# Altium schematic sheet TCAN1146_PWR_MGMT.SchDoc
size D; SheetNumber: 8; SheetTotal: 8
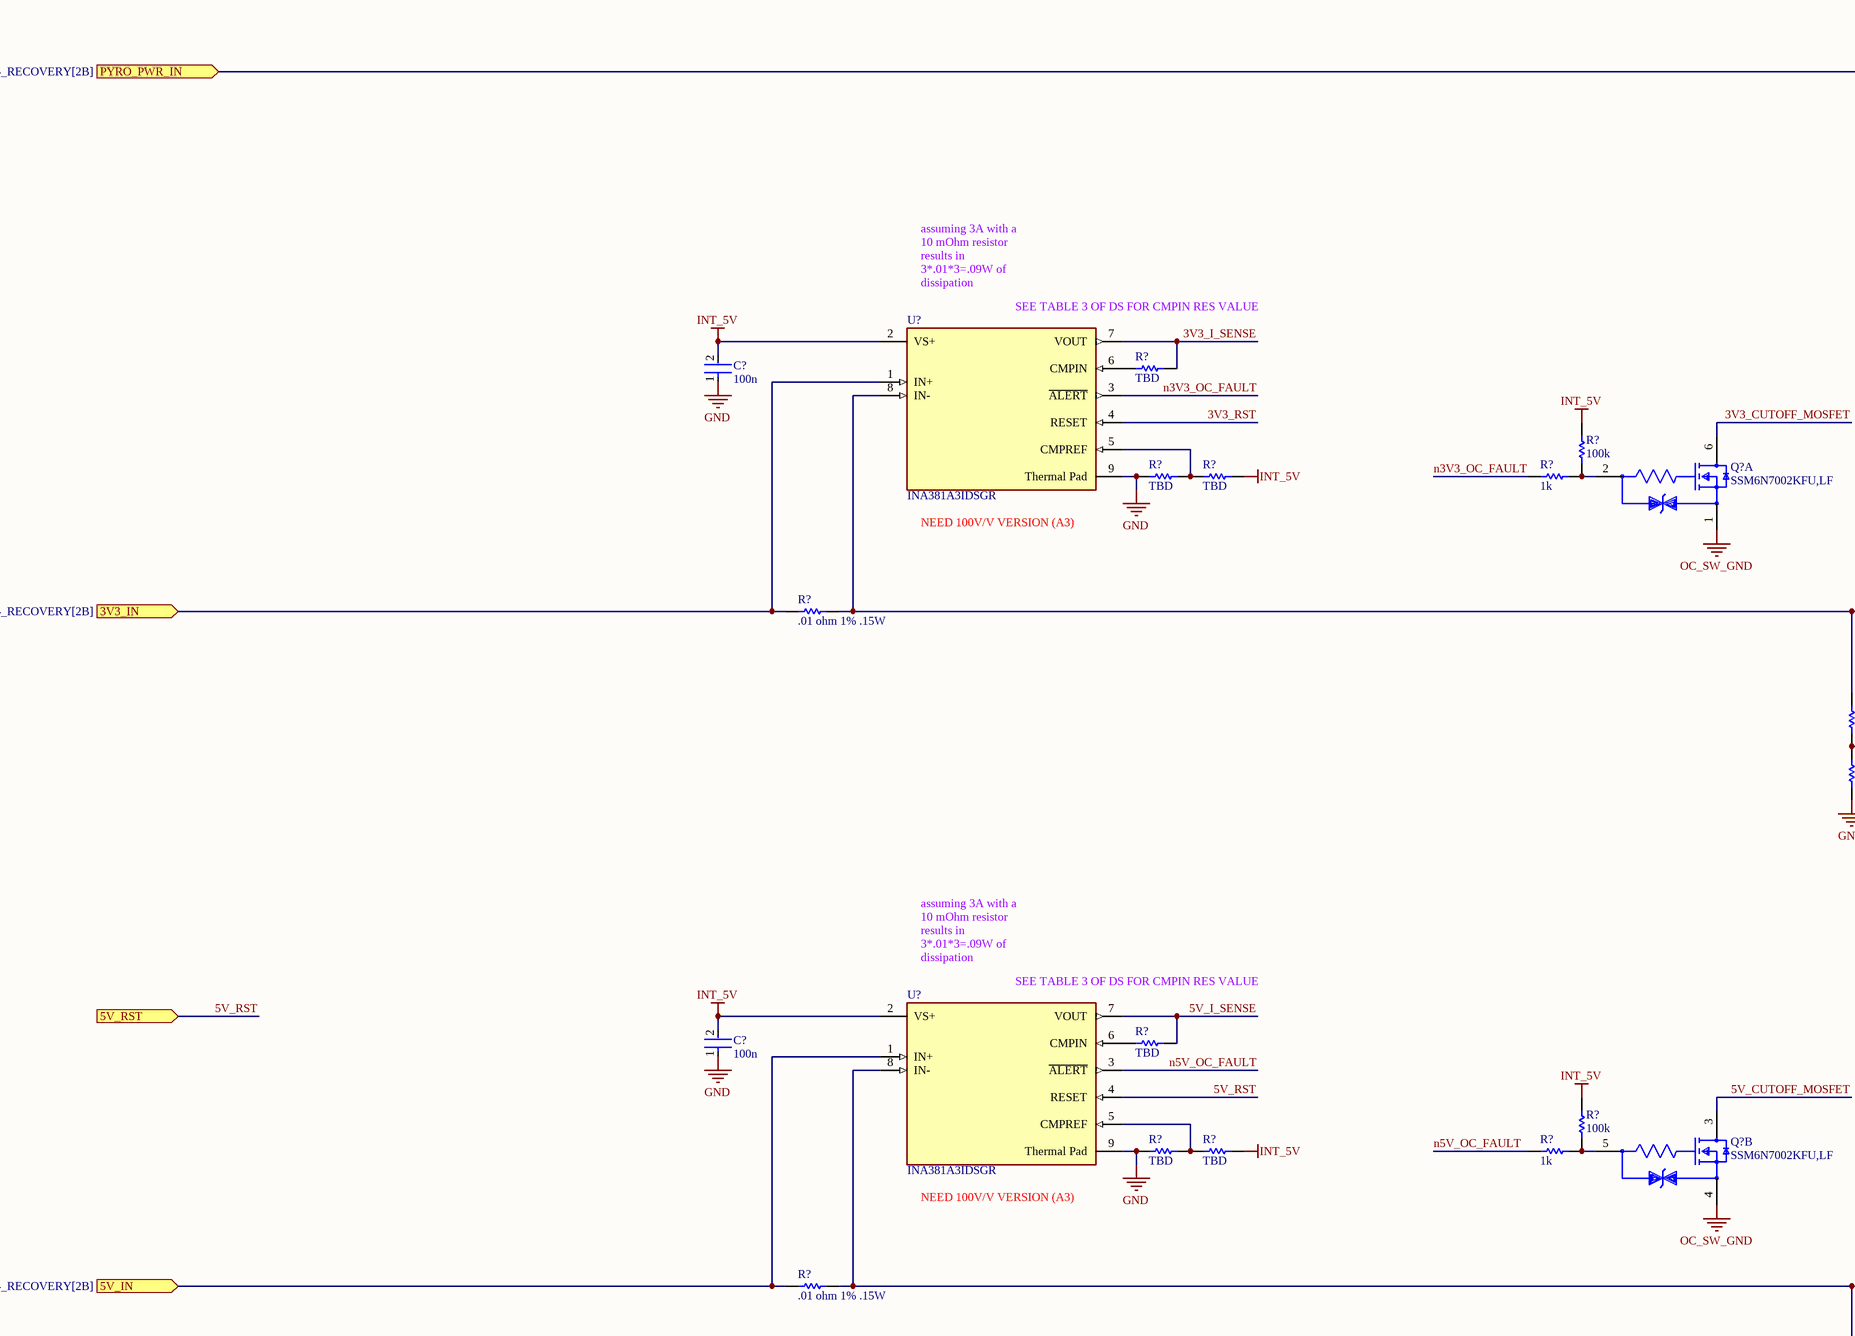
[diagram p0: TCAN1146_PWR_MGMT.SchDoc, top left]
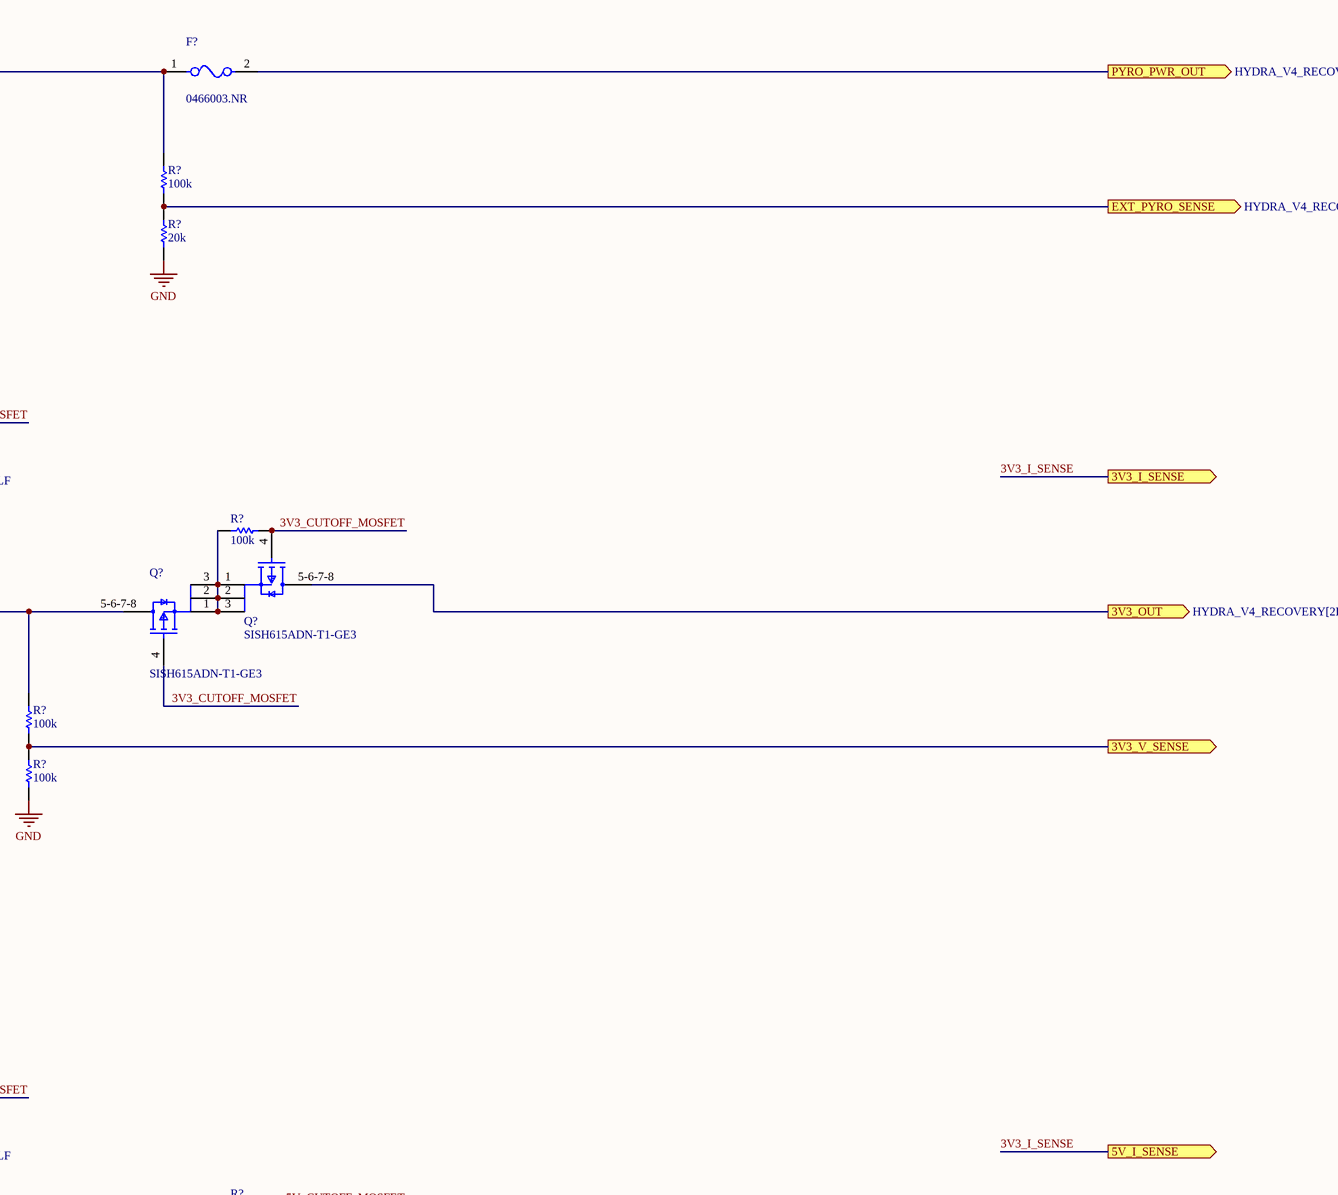
[diagram p1: TCAN1146_PWR_MGMT.SchDoc, top right]
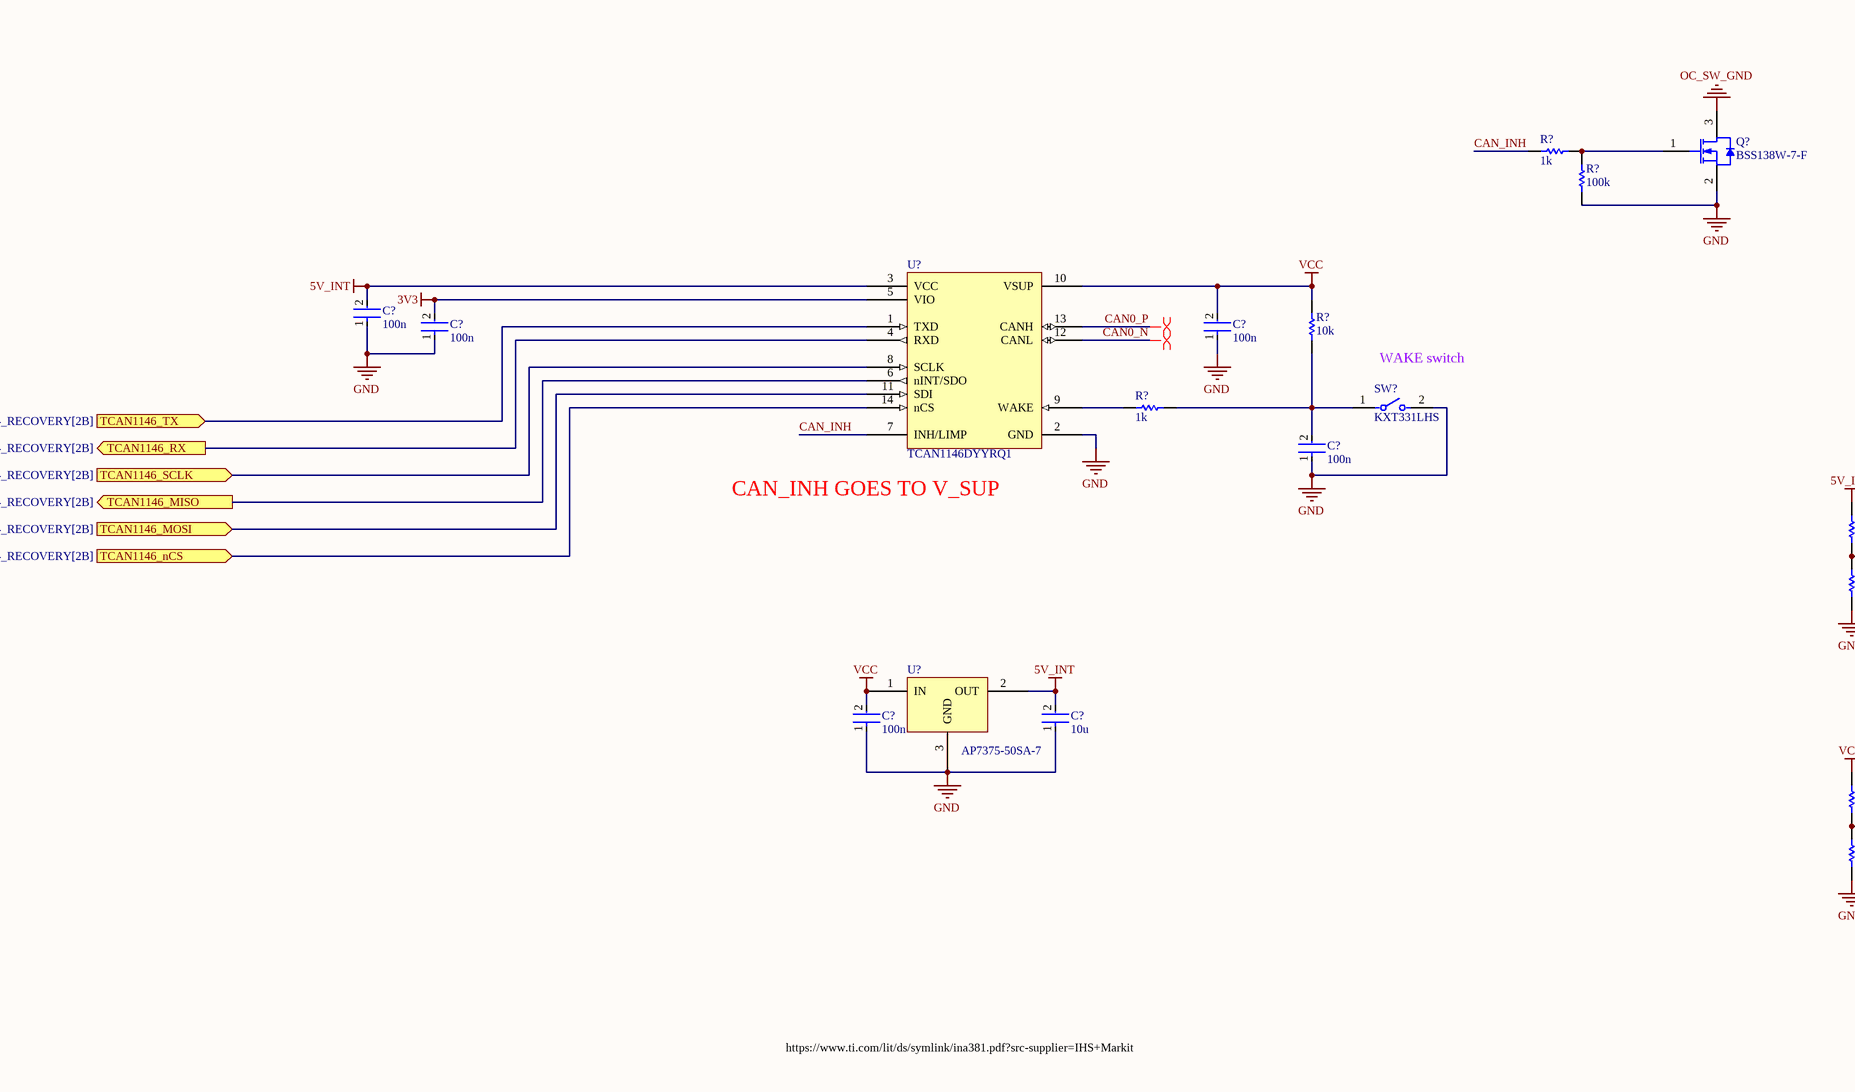
[diagram p2: TCAN1146_PWR_MGMT.SchDoc, bottom left]
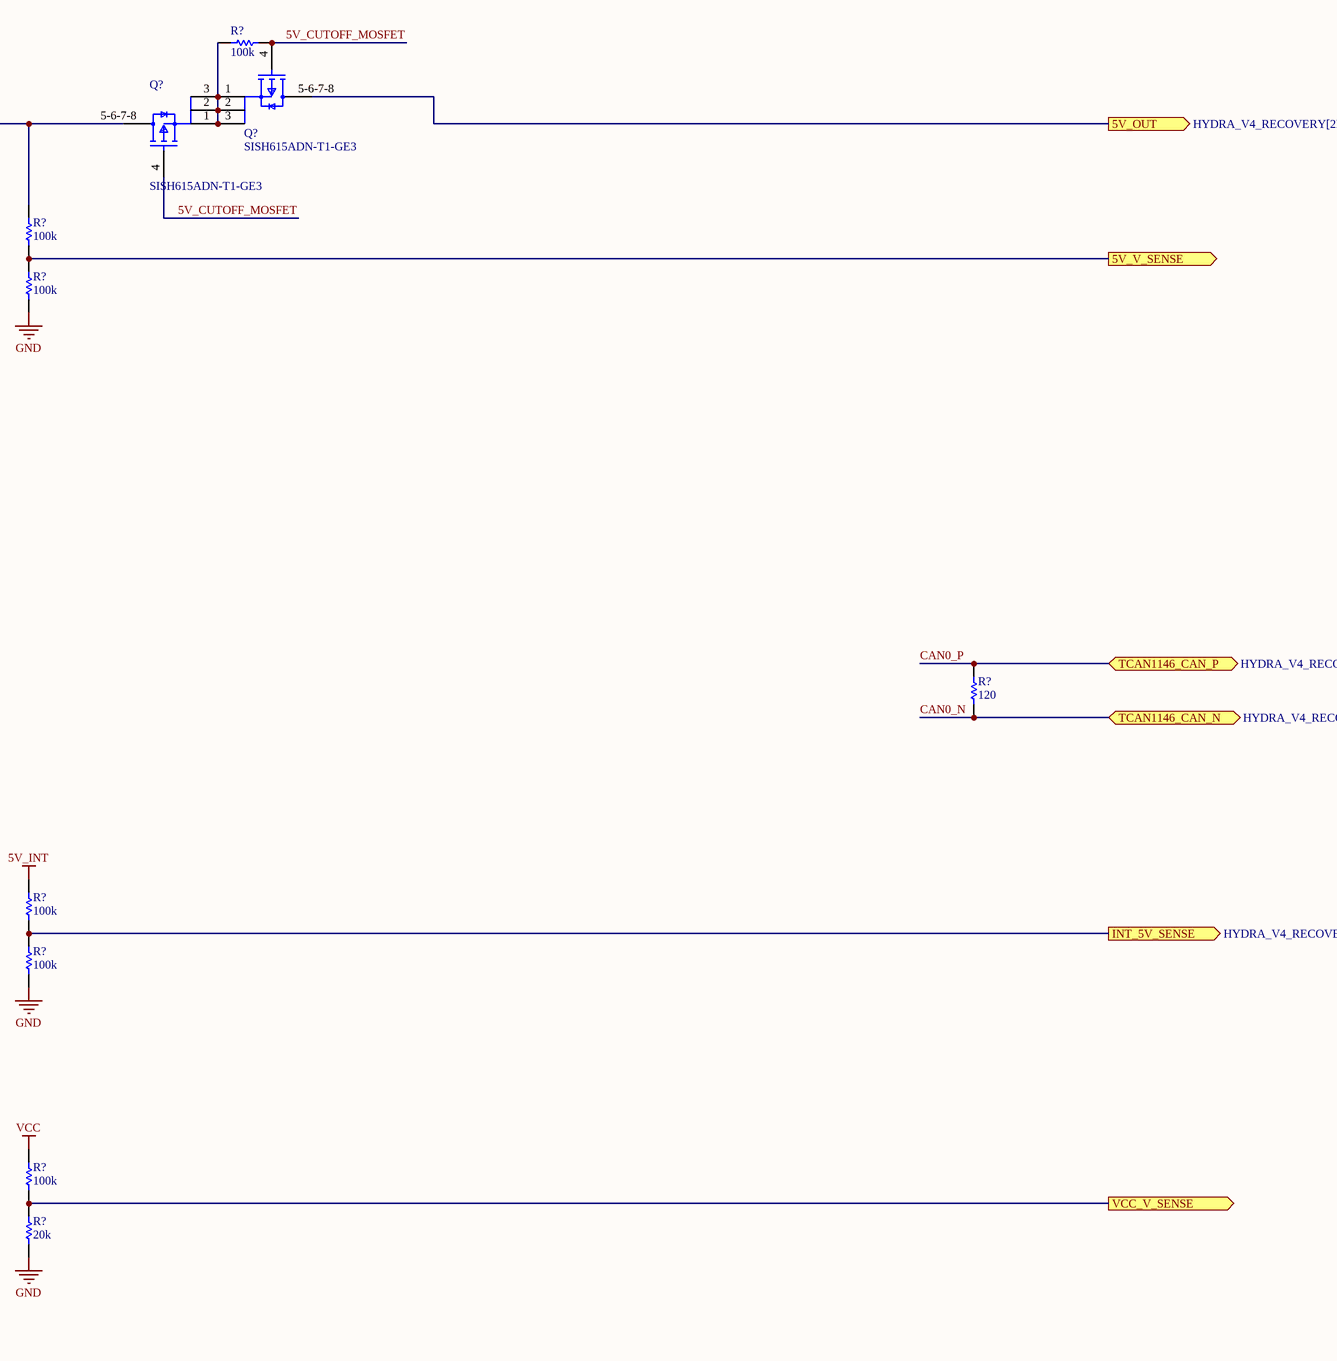
[diagram p3: TCAN1146_PWR_MGMT.SchDoc, bottom right]

## Parts
(Parts that share a designator on the sheet are numbered #1, #2 ... from top to bottom, then left to right.)
C?#1  100n  [FP-0402-L_1_0_0_05-W_0_5-IPC_A]
C?#2  100n  [FP-0402-L_1_0_0_05-W_0_5-IPC_A]
C?#3  100n  [FP-0402-L_1_0_0_05-W_0_5-IPC_A]
C?#4  100n  [FP-0402-L_1_0_0_05-W_0_5-IPC_A]
C?#5  100n  [FP-0402-L_1_0_0_05-W_0_5-IPC_A]
C?#6  100n  [FP-0402-L_1_0_0_05-W_0_5-IPC_A]
C?#7  100n  [FP-0402-L_1_0_0_05-W_0_5-IPC_A]
C?#8  10u  [FP-0402-L_1_0_0_05-W_0_5-IPC_A]
F?  0466003.NR  [FP-0466-MFG]
Q?#1  SSM6N7002KFU,LF  [FP-SSOP6-P-0_65A-MFG]  (part A of 2)
Q?#2  SISH615ADN-T1-GE3  [SISH615ADN-T1-GE3-Footprint-1]
Q?#3  SISH615ADN-T1-GE3  [SISH615ADN-T1-GE3-Footprint-1]
Q?#4  SSM6N7002KFU,LF  [FP-SSOP6-P-0_65A-MFG]  (part B of 2)
Q?#5  SISH615ADN-T1-GE3  [SISH615ADN-T1-GE3-Footprint-1]
Q?#6  SISH615ADN-T1-GE3  [SISH615ADN-T1-GE3-Footprint-1]
Q?#7  BSS138W-7-F  [DIOD-SOT323-3_V]
R?#1  100k  [R0603B]
R?#2  20k  [R0603B]
R?#3  TBD  [R0603B]
R?#4  100k  [R0603B]
R?#5  TBD  [R0603B]
R?#6  TBD  [R0603B]
R?#7  1k  [R0603B]
R?#8  100k  [R0603B]
R?#9  .01 ohm 1% .15W  [R0805B]
R?#10  100k  [R0603B]
R?#11  100k  [R0603B]
R?#12  TBD  [R0603B]
R?#13  100k  [R0603B]
R?#14  TBD  [R0603B]
R?#15  TBD  [R0603B]
R?#16  1k  [R0603B]
R?#17  100k  [R0603B]
R?#18  .01 ohm 1% .15W  [R0805B]
R?#19  100k  [R0603B]
R?#20  100k  [R0603B]
R?#21  1k  [R0603B]
R?#22  100k  [R0603B]
R?#23  120  [R0603B]
R?#24  10k  [R0603B]
R?#25  1k  [R0603B]
R?#26  100k  [R0603B]
R?#27  100k  [R0603B]
R?#28  100k  [R0603B]
R?#29  20k  [R0603B]
SW?  KXT331LHS  [FP-KXT331LHS-MFG]
U?#1  INA381A3IDSGR  [FP-DSG0008A-IPC_A]
U?#2  INA381A3IDSGR  [FP-DSG0008A-IPC_A]
U?#3  TCAN1146DYYRQ1  [TCAN1146DYYRQ1-Footprint-1]
U?#4  AP7375-50SA-7  [AP7375-50SA-7-Footprint-1]

## Ports
3V3_I_SENSE (out), 3V3_IN (in, see HYDRA_V4_RECOVERY[2B]), 3V3_OUT (out, see HYDRA_V4_RECOVERY[2B]), 3V3_V_SENSE (out), 5V_I_SENSE (out), 5V_IN (in, see HYDRA_V4_RECOVERY[2B]), 5V_OUT (out, see HYDRA_V4_RECOVERY[2B]), 5V_RST (in), 5V_V_SENSE (out), EXT_PYRO_SENSE (out, see HYDRA_V4_RECOVERY[2B]), INT_5V_SENSE (out, see HYDRA_V4_RECOVERY[2B]), PYRO_PWR_IN (in, see HYDRA_V4_RECOVERY[2B]), PYRO_PWR_OUT (out, see HYDRA_V4_RECOVERY[2B]), TCAN1146_CAN_N (bidir, see HYDRA_V4_RECOVERY[2B]), TCAN1146_CAN_P (bidir, see HYDRA_V4_RECOVERY[2B]), TCAN1146_MISO (out, see HYDRA_V4_RECOVERY[2B]), TCAN1146_MOSI (in, see HYDRA_V4_RECOVERY[2B]), TCAN1146_nCS (in, see HYDRA_V4_RECOVERY[2B]), TCAN1146_RX (out, see HYDRA_V4_RECOVERY[2B]), TCAN1146_SCLK (in, see HYDRA_V4_RECOVERY[2B]), TCAN1146_TX (in, see HYDRA_V4_RECOVERY[2B]), VCC_V_SENSE (out)

## Nets
3V3: C?#4.2 U?#3.5(VIO)
5V_INT: C?#3.2 C?#8.2 R?#26.2 U?#3.3(VCC) U?#4.2(OUT)
GND: C?#1.1 C?#2.1 C?#3.1 C?#4.1 C?#5.1 C?#6.1 C?#7.1 C?#8.1 Q?#7.2(S) R?#2.1 R?#5.1 R?#11.1 R?#14.1 R?#20.1 R?#22.2 R?#27.1 R?#29.1 SW?.2 U?#1.9(Thermal_Pad) U?#2.9(Thermal_Pad) U?#3.2(GND) U?#4.3(GND)
INT_5V: C?#1.2 C?#2.2 R?#4.2 R?#6.1 R?#13.2 R?#15.1 U?#1.2(VS+) U?#2.2(VS+)
OC_SW_GND: Q?#1.1(Source1) Q?#4.4(Source2) Q?#7.3(D)
VCC: C?#5.2 C?#7.2 R?#24.2 R?#28.2 U?#3.10(VSUP) U?#4.1(IN)
3V3_CUTOFF_MOSFET: Q?#1.6(Drain1) Q?#2.4(G) Q?#3.4(G) R?#8.2
3V3_I_SENSE: R?#3.2 U?#1.7(VOUT) ; port 3V3_I_SENSE, port 5V_I_SENSE
3V3_IN: R?#9.2 U?#1.1(IN+) ; port 3V3_IN
3V3_OUT: Q?#2.5-6-7-8(D) ; port 3V3_OUT
3V3_RST: U?#1.4(RESET)
3V3_V_SENSE: R?#10.1 R?#11.2 ; port 3V3_V_SENSE
5V_CUTOFF_MOSFET: Q?#4.3(Drain2) Q?#5.4(G) Q?#6.4(G) R?#17.2
5V_I_SENSE: R?#12.2 U?#2.7(VOUT)
5V_IN: R?#18.2 U?#2.1(IN+) ; port 5V_IN
5V_OUT: Q?#5.5-6-7-8(D) ; port 5V_OUT
5V_RST: U?#2.4(RESET) ; port 5V_RST
5V_V_SENSE: R?#19.1 R?#20.2 ; port 5V_V_SENSE
CAN0_N: R?#23.1 U?#3.12(CANL) ; port TCAN1146_CAN_N
CAN0_P: R?#23.2 U?#3.13(CANH) ; port TCAN1146_CAN_P
CAN_INH: R?#21.1 U?#3.7(INH/LIMP)
EXT_PYRO_SENSE: R?#1.1 R?#2.2 ; port EXT_PYRO_SENSE
INT_5V_SENSE: R?#26.1 R?#27.2 ; port INT_5V_SENSE
n3V3_OC_FAULT: R?#7.1 U?#1.3(~{ALERT})
n5V_OC_FAULT: R?#16.1 U?#2.3(~{ALERT})
PYRO_PWR_IN: F?.1 R?#1.2 ; port PYRO_PWR_IN
PYRO_PWR_OUT: F?.2 ; port PYRO_PWR_OUT
TCAN1146_MISO: U?#3.6(nINT/SDO) ; port TCAN1146_MISO
TCAN1146_MOSI: U?#3.11(SDI) ; port TCAN1146_MOSI
TCAN1146_nCS: U?#3.14(nCS) ; port TCAN1146_nCS
TCAN1146_RX: U?#3.4(RXD) ; port TCAN1146_RX
TCAN1146_SCLK: U?#3.8(SCLK) ; port TCAN1146_SCLK
TCAN1146_TX: U?#3.1(TXD) ; port TCAN1146_TX
VCC_V_SENSE: R?#28.1 R?#29.2 ; port VCC_V_SENSE
NetC?#6_2: C?#6.2 R?#24.1 R?#25.1 SW?.1
NetQ?#1_2: Q?#1.2(Gate1) R?#4.1 R?#7.2
NetQ?#2_1: Q?#2.1(S) Q?#2.2(S) Q?#2.3(S) Q?#3.1(S) Q?#3.2(S) Q?#3.3(S) R?#8.1
NetQ?#3_5-6-7-8: Q?#3.5-6-7-8(D) R?#9.1 R?#10.2 U?#1.8(IN-)
NetQ?#4_5: Q?#4.5(Gate2) R?#13.1 R?#16.2
NetQ?#5_1: Q?#5.1(S) Q?#5.2(S) Q?#5.3(S) Q?#6.1(S) Q?#6.2(S) Q?#6.3(S) R?#17.1
NetQ?#6_5-6-7-8: Q?#6.5-6-7-8(D) R?#18.1 R?#19.2 U?#2.8(IN-)
NetQ?#7_1: Q?#7.1(G) R?#21.2 R?#22.1
NetR?#3_1: R?#3.1 U?#1.6(CMPIN)
NetR?#5_2: R?#5.2 R?#6.2 U?#1.5(CMPREF)
NetR?#12_1: R?#12.1 U?#2.6(CMPIN)
NetR?#14_2: R?#14.2 R?#15.2 U?#2.5(CMPREF)
NetR?#25_2: R?#25.2 U?#3.9(WAKE)

## Layout directives
differential pair; differential pair class 120DIFF: CAN0_N, CAN0_P

## Notes on the sheet
- (near U?#1) assuming 3A with a 10 mOhm resistor results in 3*.01*3=.09W of dissipation
- (near U?#1) SEE TABLE 3 OF DS FOR CMPIN RES VALUE
- (near U?#1) NEED 100V/V VERSION (A3)
- (near U?#2) assuming 3A with a 10 mOhm resistor results in 3*.01*3=.09W of dissipation
- (near U?#2) SEE TABLE 3 OF DS FOR CMPIN RES VALUE
- (near U?#2) NEED 100V/V VERSION (A3)
- (near SW?) WAKE switch
- (near U?#3) CAN_INH GOES TO V_SUP
- https://www.ti.com/lit/ds/symlink/ina381.pdf?src-supplier=IHS+Markit

## Library data of the parts
C?#1-C?#8 = CMP-001-00058-1: LARGE PADS, 0402 CAP, CHANGE COMMENT TO MATCH REAL P/N; Capacitor Type: Ceramic; Min Operating Temperature: -55°C; Mounting Technology: Surface Mount; Pins: 2; Case/Package: 0402; RoHS Compliant: Yes; Max Operating Temperature: 85°C
F? = CMP-08605-000054-1: FUSE BOARD MNT 3A 32VAC/VDC 1206; Manufacturer: Littelfuse; Fuse Interrupt Ac Current: 50A; Fuse Voltage Drop: 75.99mV; Max Fuse Ac Voltage: 32V; Fuse I2T: 0.576A2Sec; Resistance: 0.019Ω; Fuse Blow Speed: Fast; Value: 0.019Ω; ComponentLink2Description: Datasheet; Fuse Current: 3A; RoHS: TRUE; Mouser Description: Surface Mount Fuses 32V 3A VFA Slimline; Height: 0.66mm; Octopart: https://octopart.com/0466003.nr-littelfuse-565175; Package: 0466; Fuse Interrupt Dc Current: 50A; Manufacturer Part Number: 0466003.NR; Temperature Range Low: -55°C; ComponentLink2URL: https://www.littelfuse.com/~/media/electronics/datasheets/fuses/littelfuse_fuse_466_datasheet.pdf.pdf; Digikey Description: FUSE BOARD MNT 3A 32VAC/VDC 1206; Voltage Rating: 32V; Category: Fuse; Lead Free: Yes; Device Class L2: Fuses; Automotive: No; Max Fuse Dc Voltage: 32V; Temperature Range High: +90°C; Device Class L3: unset; Device Class L1: Circuit Protection; Temperature: -55°C to +90°C
Q?#1 Q?#4 = CMP-35916-000009-1: MOSFET 2N-CH 60V 0.3A; Input Capacitance: 40pF; Continuous Drain Current (ID): 300mA; Max Power Dissipation: 285mW; FET Type: 2 N-Channel; Rds On Max: 1.5R; Mount: Surface Mount; Drain to Source Voltage (Vdss): 60V; Packaging: Tape and Reel
Q?#2 Q?#3 Q?#5 Q?#6 = CMP-013-00018-2: Trans MOSFET P-CH 20V 22.1A 8-Pin PowerPAK 1212 EP T/R; Source: SISH615ADN-T1-GE3.SchLib; Design Item ID: CMP-013-00036-4; Component Type: Standard; Pins: 5
Q?#7 = CMP-2000-05968-1: N-Channel Enhancement Mode Mosfet, 50 V, 200 mA, -55 to 150 degC, 6-Pin SOT-323, RoHS, Tape and Reel; Typical Turn-Off Delay Time: 20ns; Number of Channels: 1Channel; Type: EnhancementModeFieldEffectTransistor; Brand: DiodesIncorporated; Vds - Drain-Source Breakdown Voltage: 75V; Vgs - Gate-Source Voltage: 20V; Rds On - Drain-Source Resistance: 1.4Ohms; Transistor Type: 1N-Channel; Configuration: Single; Unit Weight: 0.000212oz; Pd - Power Dissipation: 200mW; Id - Continuous Drain Current: 200mA; Forward Transconductance - Min: 0.1S; Manufacturer URL: http://www.diodes.com/; Series: BSS138; Package Description: 3-Pin Small Outline Transistor, Body 2 x 1.25 mm, Pitch 0.65 mm; Mounting Technology: SurfaceMount; Product Category: MOSFET; RoHS: True; Maximum Operating Temperature: +150C; Height: 1mm; Length: 2.2mm; Technology: Si; Width: 1.35mm; Datasheet URL: http://www.diodes.com/_files/datasheets/ds30206.pdf; Manufacturer: DiodesIncorporated; Package / Case: SOT-323-3; Typical Turn-On Delay Time: 20ns; Transistor Polarity: N-Channel; Factory Pack Quantity: 3000; Packaging: Reel; Product: MOSFETSmallSignal; Datasheet Version: Rev. 11-2, 09/2013; Package Reference: SOT323; Minimum Operating Temperature: -55C; Mounting Style: SMD/SMT; Channel Mode: Enhancement
R?#1-R?#29 = CMP-009-00002-14: Resistor
SW? = CMP-10040-000029-1: SWITCH TACTILE SPST-NO 0.02A 15V; Operating Force: 240gf; Switch Travel: 0.13mm; Illumination Type: Non-Illuminated; Throw Configuration: SPST; Number of Ports: 1; Current Rating: 5A; Mechanical Life: 500000Cycles; Switch Function: Off-Mom; Connector Type: USB; Actuator Type: Standard; Gender: Receptacle; Number of Contacts: 24; Contact Plating: Gold; Insulation Color: Black; Min Operating Temperature: -40°C; Packaging: Tape and Reel; Flammability Rating: UL94 V-0; Max Operating Temperature: 85°C; Termination: Solder; Mount: Surface Mount
U?#1 U?#2 = CMP-04895-000238-1: LOW COST CURRENT SENSOR WITH COM; Number of Channels: 1; Max Operating Temperature: 125°C; Min Operating Temperature: -40°C; RoHS Compliant: Yes
U?#3 = CMP-318-000000-2: Automotive CAN FD transceiver with watchdog, bus diagnostics and partial networking via sele 14-SOT-23-THIN -40 to 150; Component Type: Standard; Design Item ID: CMP-015-00012-2; Pin Count: 14; Source: TCAN1146DYYRQ1.SchLib
U?#4 = CMP-019-00041-1: Ldo Cmos Lowcurr SOT23 T&r 3K